# Altium project 无线充电3.0.PrjPcb
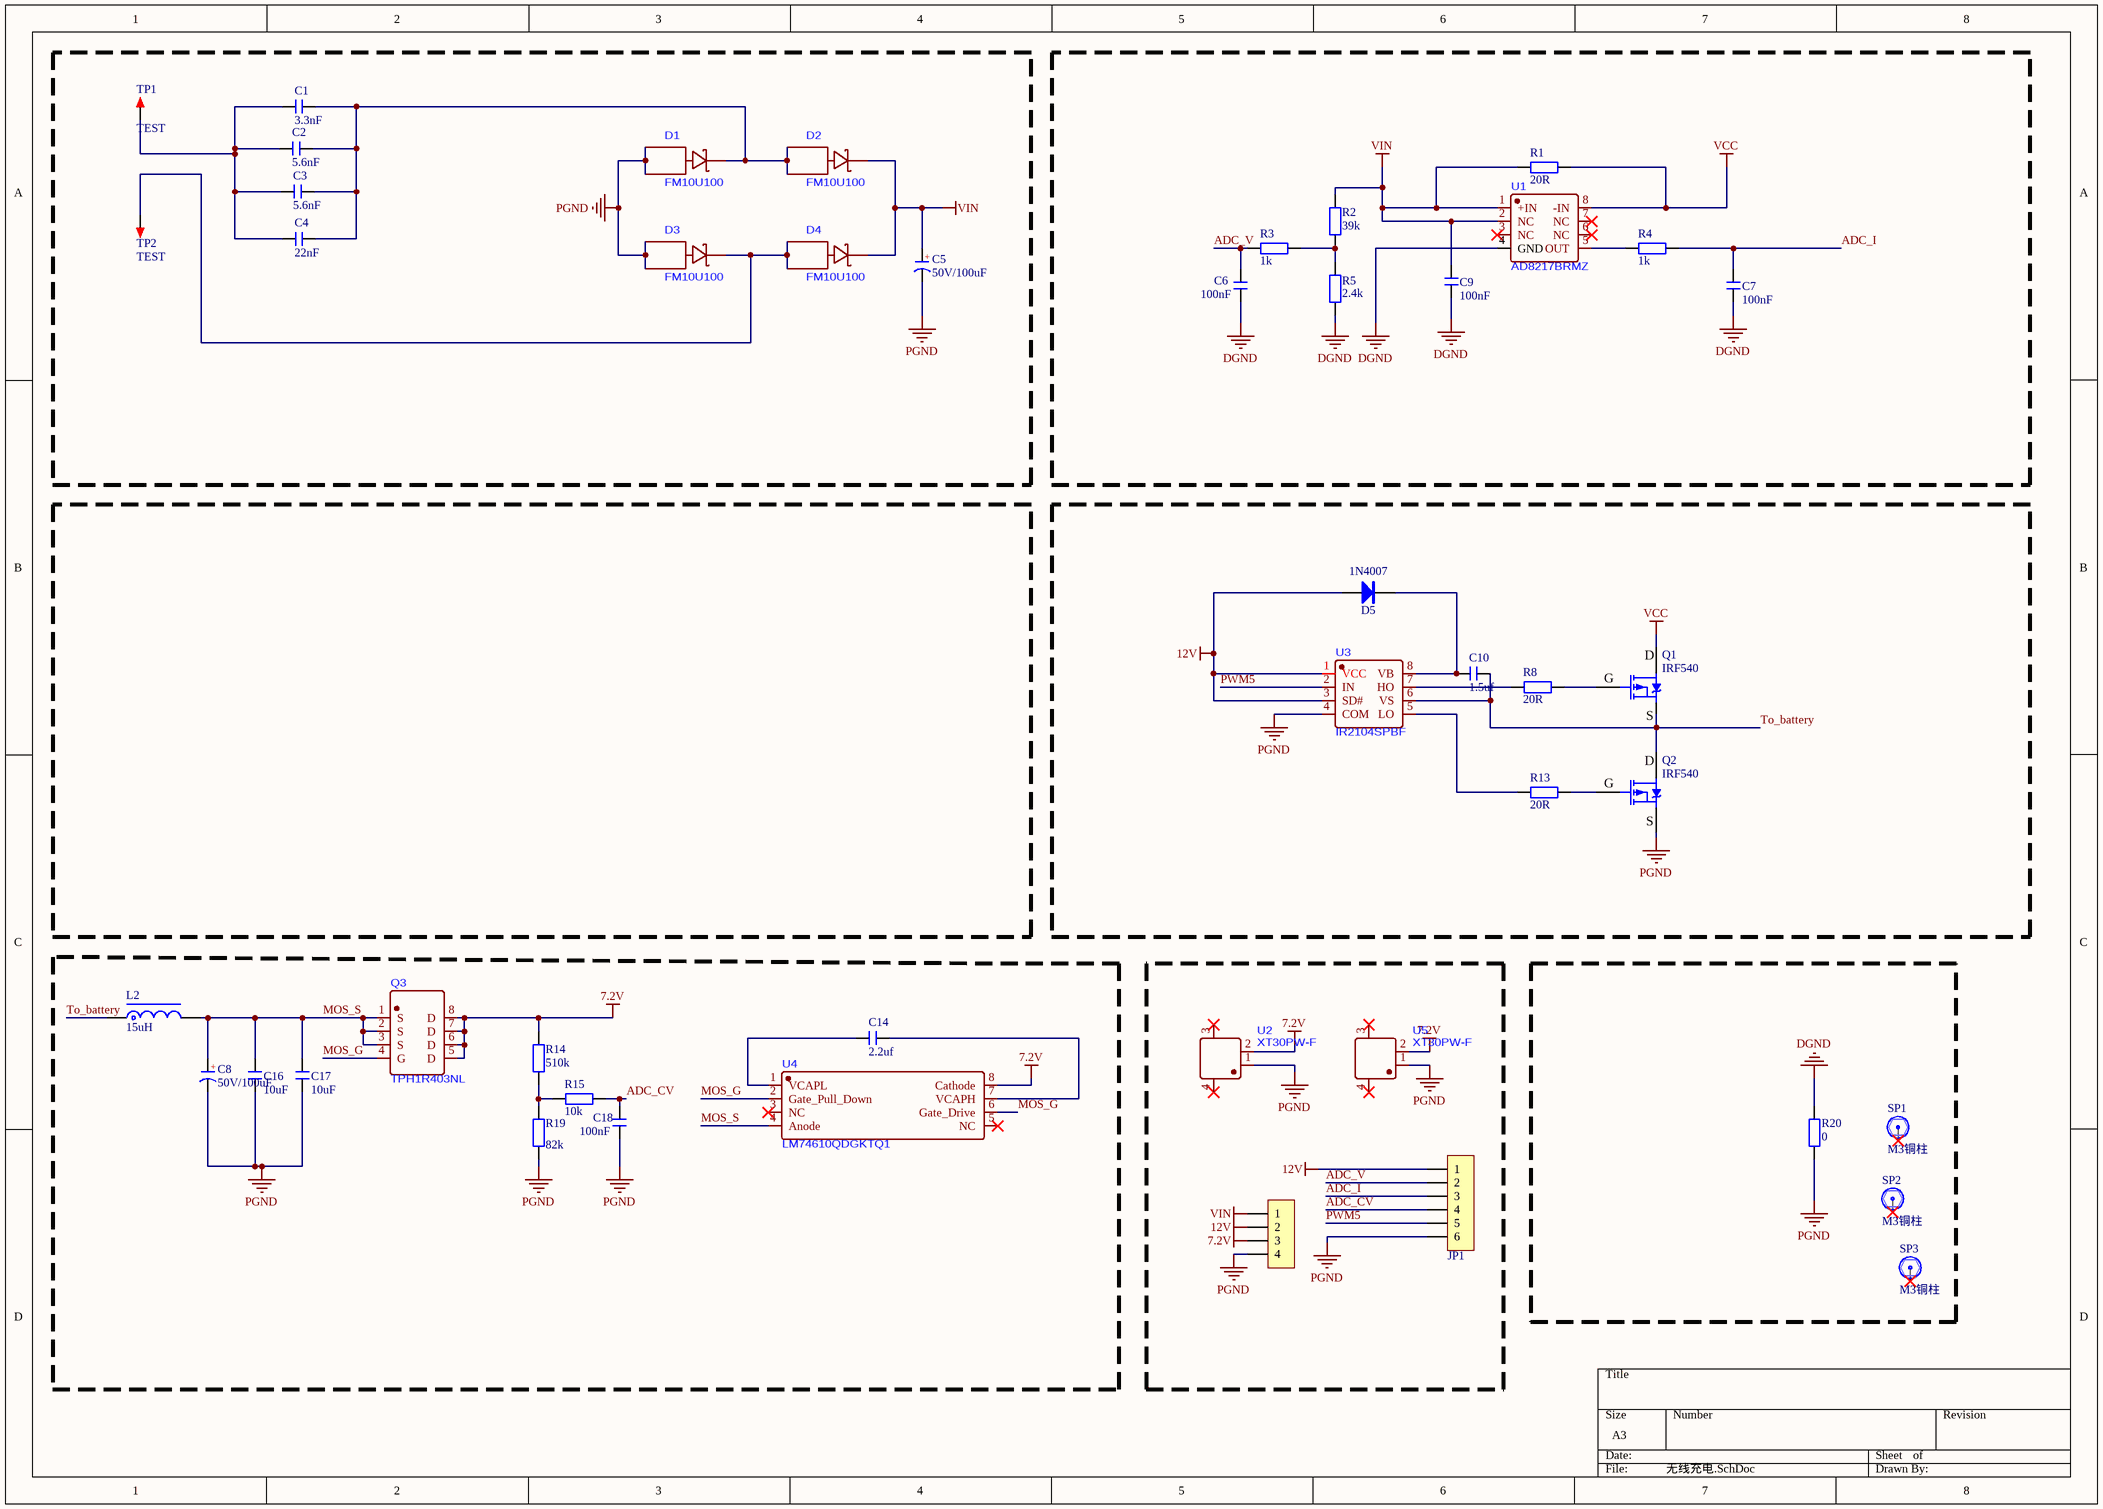
[diagram p0: 无线充电.SchDoc]
1 sheet, 46 parts. Net scope: global (net labels, ports and power ports of the same name join across sheets).
Board file: 无线充电.PcbDoc

## Sheet 无线充电.SchDoc
size A3; DocumentNumber: 1; SheetNumber: 1; SheetTotal: 1

### Parts
C1  value 3.3nF  [C 1210_M]  (hidden comment: C)
C2  value 5.6nF  [C 1210_M]  (hidden comment: C)
C3  value 5.6nF  [C 1210_M]  (hidden comment: C)
C4  value 22nF  [C 1210_M]  (hidden comment: C)
C5  value 50V/100uF  [CM E(8*10.2)]  (hidden comment: C-CM)
C6  value 100nF  [C 0603_M]  (hidden comment: C)
C7  value 100nF  [C 0603_M]  (hidden comment: C)
C8  value 50V/100uF  [CM E(8*10.2)]  (hidden comment: C-CM)
C9  value 100nF  [C 0603_M]  (hidden comment: C)
C10  1.5uf  [C 0603]
C14  2.2uf  [C 0603]
C16  value 10uF  [C 1210_M]  (hidden comment: C)
C17  value 10uF  [C 1210_M]  (hidden comment: C)
C18  value 100nF  [C 0603_M]  (hidden comment: C)
D1  FM10U100  [TO-277B_3P-L6.1-W4.3-LS7.0-TR]
D2  FM10U100  [TO-277B_3P-L6.1-W4.3-LS7.0-TR]
D3  FM10U100  [TO-277B_3P-L6.1-W4.3-LS7.0-TR]
D4  FM10U100  [TO-277B_3P-L6.1-W4.3-LS7.0-TR]
D5  1N4007  [SMA]
JP1  HDR-1X6  [XH2.54-WI-6P]  (value not drawn)
L2  value 15uH  [CD104]  (hidden comment: L-CD)
Q1  IRF540  [TO263-3B]
Q2  IRF540  [TO263-3B]
Q3  TPH1R403NL  [DSOP-8_L5.0-W5.0-P1.27-EP-TL]
R1  value 20R  [R 2512_M]  (hidden comment: R)
R2  value 39k  [R 0603_M]  (hidden comment: R)
R3  value 1k  [R 0603_M]  (hidden comment: R)
R4  value 1k  [R 0603_M]  (hidden comment: R)
R5  value 2.4k  [R 0603_M]  (hidden comment: R)
R8  20R  [R 0603]
R13  20R  [R 0603]
R14  value 510k  [R 0603_M]  (hidden comment: R)
R15  value 10k  [R 0603_M]  (hidden comment: R)
R19  value 82k  [R 0603_M]  (hidden comment: R)
R20  value 0  [R 1206_L]  (hidden comment: R)
SP1  M3铜柱  [M3x4_L]
SP2  M3铜柱  [M3x4_L]
SP3  M3铜柱  [M3x4_L]
test1  HDR-1X4  [HDR2.54-LI-4P]  (value not drawn)
TP1  TEST  [TEST 1.6]
TP2  TEST  [TEST 1.6]
U1  AD8217BRMZ  [MSOP-8_L3.0-W3.0-P0.65-LS4.9-BL]
U2  XT30PW-F  [CONN-TH_XT30PW-F]
U3  IR2104SPBF  [SOIC-8_L5.0-W4.0-P1.27-LS6.0-BL]
U4  LM74610QDGKTQ1  [VSSOP-8_L3.0-W3.0-P0.65-LS5.0-BL]
U5  XT30PW-F  [CONN-TH_XT30PW-F]

### Nets
7.2V: Q3.5(D) Q3.6(D) Q3.7(D) Q3.8(D) R14.2 test1.3 U2.2 U4.8(Cathode) U5.2
12V: D5.1(A) JP1.1 test1.2 U3.1(VCC) U3.3(SD#)
DGND: C6.1 C7.1 C9.2 R5.1 R20.1 U1.4(GND)
PGND: C5.2(K) C8.2(K) C16.1 C17.1 C18.1 D1.1(A) D1.3(A) D3.1(A) D3.3(A) JP1.6 Q2.3(S) R19.1 R20.2 test1.4 U2.1 U3.4(COM) U5.1
VCC: Q1.2(D) R1.2 U1.8(-IN)
VIN: C5.1(A) C9.1 D2.2(C) D4.2(C) R1.1 R2.2 test1.1 U1.1(+IN) U1.2(NC)
ADC_CV: C18.2 JP1.4 R15.1
ADC_I: C7.2 JP1.3 R4.2
ADC_V: C6.2 JP1.2 R3.2
MOS_G: Q3.4(G) U4.2(Gate_Pull_Down) U4.6(Gate_Drive)
MOS_S: C8.1(A) C16.2 C17.2 L2.2 Q3.1(S) Q3.2(S) Q3.3(S) U4.4(Anode)
PWM5: JP1.5 U3.2(IN)
To_battery: C10.2 L2.1 Q1.3(S) Q2.2(D) U3.6(VS)
NetC1_1: C1.1 C2.1 C3.1 C4.1 TP1.1
NetC1_2: C1.2 C2.2 C3.2 C4.2 D1.2(C) D2.1(A) D2.3(A)
NetC10_1: C10.1 D5.2(K) U3.8(VB)
NetC14_1: C14.1 U4.1(VCAPL)
NetC14_2: C14.2 U4.7(VCAPH)
NetD3_2: D3.2(C) D4.1(A) D4.3(A) TP2.1
NetQ1_1: Q1.1(G) R8.2
NetQ2_1: Q2.1(G) R13.2
NetR2_1: R2.1 R3.1 R5.2
NetR4_1: R4.1 U1.5(OUT)
NetR8_1: R8.1 U3.7(HO)
NetR13_1: R13.1 U3.5(LO)
NetR14_1: R14.1 R15.2 R19.2

Not connected (* = marked no-connect by the designer): SP1 1*; SP2 1*; SP3 1*; U1 3(NC)* 6(NC)* 7(NC)*; U2 3* 4*; U4 3(NC)* 5(NC)*; U5 3* 4*

### Notes on the sheet
- (in symbol C-CM) +

### Library data of the parts
C1-C4 C6 C7 C9 C16-C18 = C: 无极性贴片电容; 版权归属: 电协硬件组
C5 C8 = C-CM: 贴片电解电容; 版权归属: 电协硬件组
C10 C14 = C: 无极性贴片电容; 版权归属: 源创客; BOM名称: 无极性贴片电容; 学习资源: www.ooocke.com
D5 = SS14: 肖特基二极管; 版权归属: 电协硬件组
JP1 = Header 6: 6P接插件; 版权归属: 源创客; BOM名称: 6P接插件; 学习资源: www.ooocke.com
L2 = L-CD: 贴片功率电感; 版权归属: 电协硬件组
Q1 Q2 = IRF540: P沟场效应管; 版权归属: 电协硬件组
R1-R5 R14 R15 R19 R20 = R: 贴片电阻; 版权归属: 电协硬件组
R8 R13 = R: 贴片电阻; 版权归属: 源创客; BOM名称: 贴片电阻; 学习资源: www.ooocke.com
SP1-SP3 = 铜柱小焊盘: 铜柱; 版权归属: 电协硬件组
test1 = Header 4: 4P接插件; 版权归属: 源创客; BOM名称: 4P接插件; 学习资源: www.ooocke.com
TP1 TP2 = TEST: 测试点; 版权归属: 电协硬件组